# Altium project lightSoakV1-input-buffer-board.PrjPcb
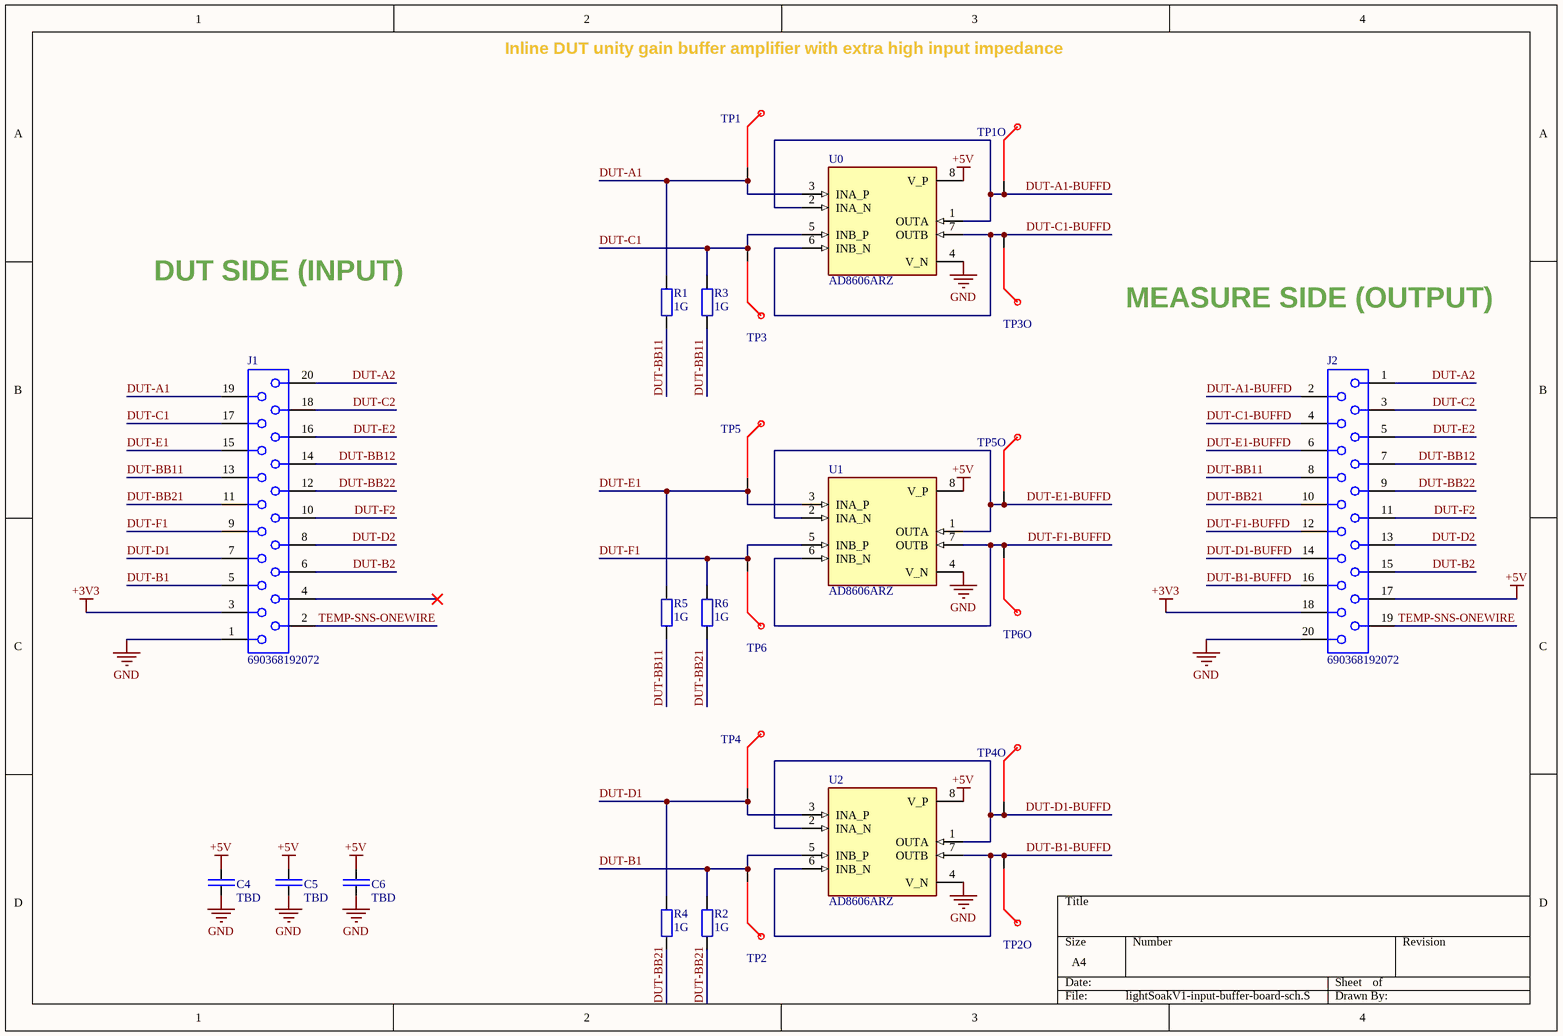
[diagram p0: lightSoakV1-input-buffer-board-sch.SchDoc]
1 sheet, 26 parts. Net scope: global (net labels, ports and power ports of the same name join across sheets).
Board file: lightSoakV1-input-buffer-board-pcb.PcbDoc

## Sheet lightSoakV1-input-buffer-board-sch.SchDoc
size A4; SheetNumber: 1; SheetTotal: 1

### Parts
C4  value TBD  [FPR_0603_C_R0]  (hidden comment: C)
C5  value TBD  [FPR_0603_C_R0]  (hidden comment: C)
C6  value TBD  [FPR_0603_C_R0]  (hidden comment: C)
J1  690368192072  [690368192072]
J2  690368192072  [690368192072]
R1  value 1G  [FPR_0805_R_R0]  (hidden comment: R_1G)
R2  value 1G  [FPR_0805_R_R0]  (hidden comment: R_1G)
R3  value 1G  [FPR_0805_R_R0]  (hidden comment: R_1G)
R4  value 1G  [FPR_0805_R_R0]  (hidden comment: R_1G)
R5  value 1G  [FPR_0805_R_R0]  (hidden comment: R_1G)
R6  value 1G  [FPR_0805_R_R0]  (hidden comment: R_1G)
TP1  Test Point  [Test Point 1.5mm SMD]  (value not drawn)
TP1O  Test Point  [Test Point 1.5mm SMD]  (value not drawn)
TP2  Test Point  [Test Point 1.5mm SMD]  (value not drawn)
TP2O  Test Point  [Test Point 1.5mm SMD]  (value not drawn)
TP3  Test Point  [Test Point 1.5mm SMD]  (value not drawn)
TP3O  Test Point  [Test Point 1.5mm SMD]  (value not drawn)
TP4  Test Point  [Test Point 1.5mm SMD]  (value not drawn)
TP4O  Test Point  [Test Point 1.5mm SMD]  (value not drawn)
TP5  Test Point  [Test Point 1.5mm SMD]  (value not drawn)
TP5O  Test Point  [Test Point 1.5mm SMD]  (value not drawn)
TP6  Test Point  [Test Point 1.5mm SMD]  (value not drawn)
TP6O  Test Point  [Test Point 1.5mm SMD]  (value not drawn)
U0  AD8606ARZ  [SOIC127P600X175-8N]
U1  AD8606ARZ  [SOIC127P600X175-8N]
U2  AD8606ARZ  [SOIC127P600X175-8N]

### Nets
+3V3: J1.3 J2.18
+5V: C4.2 C5.2 C6.2 J2.17 U0.8(V_P) U1.8(V_P) U2.8(V_P)
GND: C4.1 C5.1 C6.1 J1.1 J2.20 U0.4(V_N) U1.4(V_N) U2.4(V_N)
DUT-A1: J1.19 R1.2 TP1.1 U0.3(INA_P)
DUT-A1-BUFFD: J2.2 TP1O.1 U0.1(OUTA) U0.2(INA_N)
DUT-A2: J1.20 J2.1
DUT-B1: J1.5 R2.2 TP2.1 U2.5(INB_P)
DUT-B1-BUFFD: J2.16 TP2O.1 U2.6(INB_N) U2.7(OUTB)
DUT-B2: J1.6 J2.15
DUT-BB11: J1.13 J2.8 R1.1 R3.1 R5.1
DUT-BB12: J1.14 J2.7
DUT-BB21: J1.11 J2.10 R2.1 R4.1 R6.1
DUT-BB22: J1.12 J2.9
DUT-C1: J1.17 R3.2 TP3.1 U0.5(INB_P)
DUT-C1-BUFFD: J2.4 TP3O.1 U0.6(INB_N) U0.7(OUTB)
DUT-C2: J1.18 J2.3
DUT-D1: J1.7 R4.2 TP4.1 U2.3(INA_P)
DUT-D1-BUFFD: J2.14 TP4O.1 U2.1(OUTA) U2.2(INA_N)
DUT-D2: J1.8 J2.13
DUT-E1: J1.15 R5.2 TP5.1 U1.3(INA_P)
DUT-E1-BUFFD: J2.6 TP5O.1 U1.1(OUTA) U1.2(INA_N)
DUT-E2: J1.16 J2.5
DUT-F1: J1.9 R6.2 TP6.1 U1.5(INB_P)
DUT-F1-BUFFD: J2.12 TP6O.1 U1.6(INB_N) U1.7(OUTB)
DUT-F2: J1.10 J2.11
TEMP-SNS-ONEWIRE: J1.2 J2.19

Not connected (* = marked no-connect by the designer): J1 4*

### Notes on the sheet
- Inline DUT unity gain buffer amplifier with extra high input impedance
- DUT SIDE (INPUT)
- MEASURE SIDE (OUTPUT)

### Library data of the parts
C4-C6 = C: Capacitor - generic SMD
J1 J2 = 690368192072: WR-MM Mini Module Connector, Female, THT, with Latch & Polarization, Angled, pitch 2.54mm, 20p; Manufacturer: Wurth Elektronik; Insulation Resistance: 1000MΩ; Rated Current: 1.5A; Working Voltage: 250VAC; Withstanding Voltage: 500VAC; Contact Resistance: 10mΩ; ComponentLink1Description: Website Link; ComponentLink1URL: https://www.we-online.com/redexpert/article/690368192072?ad; ComponentLink2Description: Datasheet Link; ComponentLink2URL: https://www.we-online.com/redexpert/spec/690368192072?ad; Manufacturer Part Number: 690368192072; Pitch: 2.54mm; Packaging: Tube; Gender: Female; Length: 30mm; Category: Board-to-Board Connectors; Match Code: WR-MM; Mount: Through Hole; Operating Temperature Max: 105°C; Operating Temperature Min: -40°C; Number of Pins: 20; Orientation: Angled
R1-R6 = R: Resistor - generic SMD
U0-U2 = AD8606ARZ: Dual rail to rail OP-AMP; MF: Analog Devices; Value: *; Package: SOIC-8 Analog Devices; Price: None; MP: AD8606ARZ; Availability: Unavailable; SnapEDA_Link: https://www.snapeda.com/parts/AD8606ARZ/Analog%20Devices%20Inc./view-part/43414/?ref=snap